# Altium project 3D Printer Control Board.PrjPcb
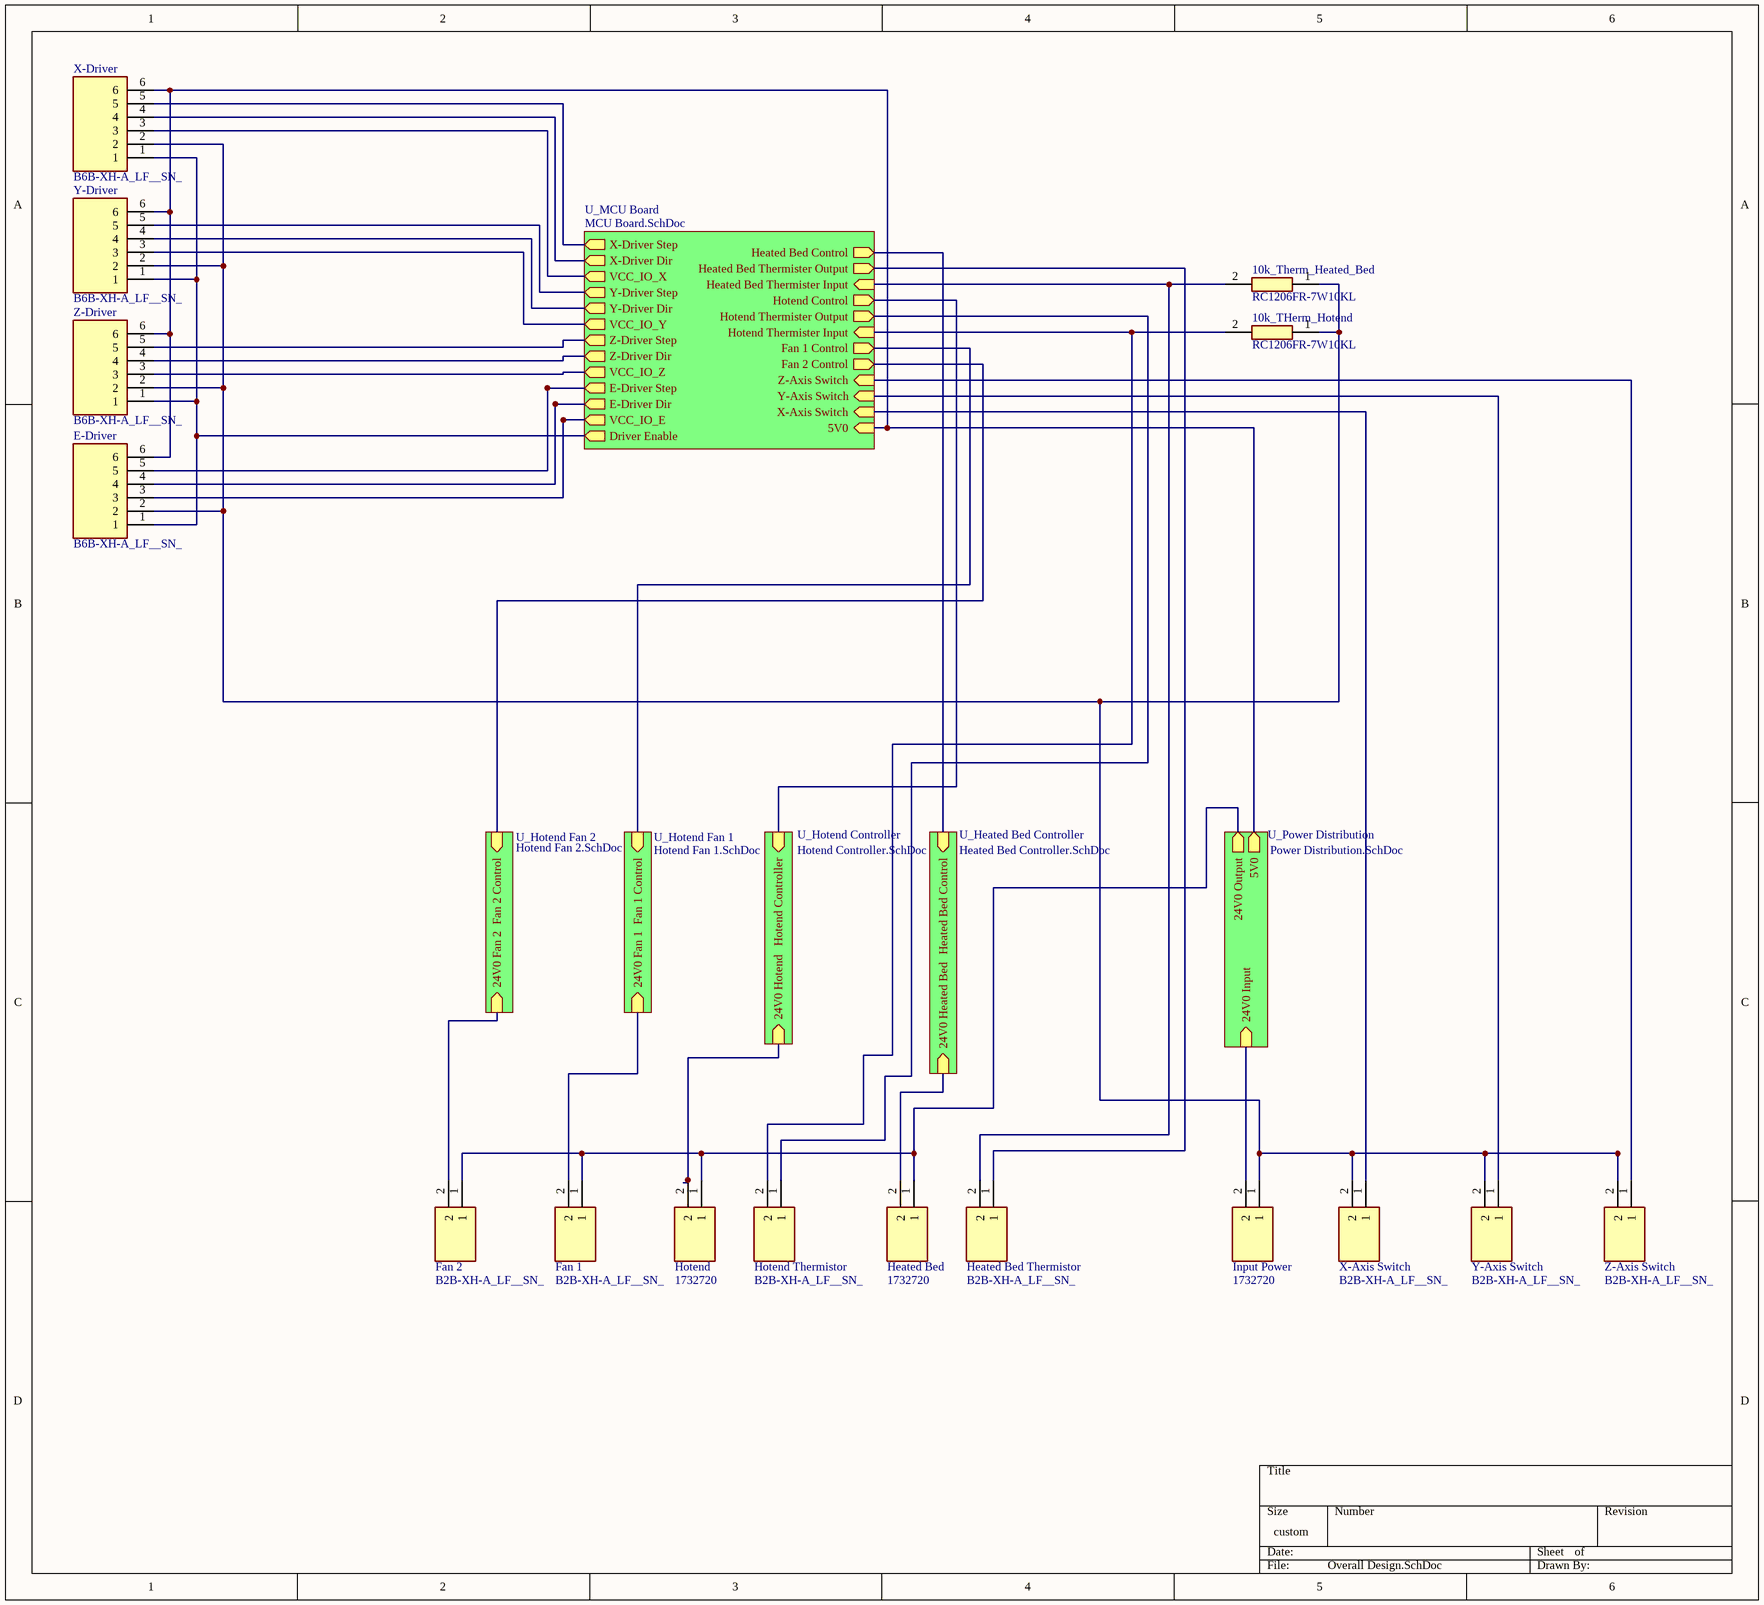
[diagram p0: Overall Design.SchDoc]
4 sheets, 24 parts. Net scope: hierarchical (ports join the sheet entries above them; power ports are global).
Board file: 3d Printer Control PCB.PcbDoc
Sheets:
  Overall Design.SchDoc
    U_Hotend Fan 1 = Hotend Fan 1.SchDoc
    U_Power Distribution = Power Distribution.SchDoc
    U_MCU Board = MCU Board.SchDoc

## Sheet Overall Design.SchDoc
size 330 x 299 mm; SheetNumber: 1; SheetTotal: 7

### Parts
10k_Therm_Heated_Bed  RC1206FR-7W10KL  [RESC3116X65N]
10k_THerm_Hotend  RC1206FR-7W10KL  [RESC3116X65N]
E-Driver  B6B-XH-A_LF__SN_  [SHDR6W64P0X250_1X6_1740X575X700P]
Fan_1  B2B-XH-A_LF__SN_  [SHDR2W64P0X250_1X2_740X575X700P]
Fan_2  B2B-XH-A_LF__SN_  [SHDR2W64P0X250_1X2_740X575X700P]
Heated_Bed  1732720  [1732720]
Heated_Bed_Thermistor  B2B-XH-A_LF__SN_  [SHDR2W64P0X250_1X2_740X575X700P]
Hotend  1732720  [1732720]
Hotend_Thermistor  B2B-XH-A_LF__SN_  [SHDR2W64P0X250_1X2_740X575X700P]
Input_Power  1732720  [1732720]
X-Axis_Switch  B2B-XH-A_LF__SN_  [SHDR2W64P0X250_1X2_740X575X700P]
X-Driver  B6B-XH-A_LF__SN_  [SHDR6W64P0X250_1X6_1740X575X700P]
Y-Axis_Switch  B2B-XH-A_LF__SN_  [SHDR2W64P0X250_1X2_740X575X700P]
Y-Driver  B6B-XH-A_LF__SN_  [SHDR6W64P0X250_1X6_1740X575X700P]
Z-Axis_Switch  B2B-XH-A_LF__SN_  [SHDR2W64P0X250_1X2_740X575X700P]
Z-Driver  B6B-XH-A_LF__SN_  [SHDR6W64P0X250_1X6_1740X575X700P]

### Sub-sheets
U_Heated Bed Controller = Heated Bed Controller.SchDoc (file not in this document): Heated Bed Control (in), 24V0 Heated Bed (in)
U_Hotend Controller = Hotend Controller.SchDoc (file not in this document): Hotend Controller (in), 24V0 Hotend (in)
U_Hotend Fan 1 = Hotend Fan 1.SchDoc: Fan 1 Control (in), 24V0 Fan 1 (in)
U_Hotend Fan 2 = Hotend Fan 2.SchDoc (file not in this document): Fan 2 Control (in), 24V0 Fan 2 (in)
U_MCU Board = MCU Board.SchDoc: X-Driver Dir (out), Y-Driver Dir (out), E-Driver Dir (out), 5V0 (in), X-Axis Switch (in), Y-Axis Switch (in), Z-Axis Switch (in), Driver Enable (out), Heated Bed Control (out), Heated Bed Thermister Output (out), Hotend Control (out), Hotend Thermister Output (out), Heated Bed Thermister Input (in), Hotend Thermister Input (in), Fan 1 Control (out), Fan 2 Control (out), X-Driver Step (out), VCC_IO_X (out), Y-Driver Step (out), VCC_IO_Y (out), Z-Driver Step (out), VCC_IO_Z (out), E-Driver Step (out), VCC_IO_E (out), Z-Driver Dir (out)
U_Power Distribution = Power Distribution.SchDoc: 5V0 (out), 24V0 Output (out), 24V0 Input (in)

### Nets
Net10k_Ohms_Fan_1_2: sheet U_Hotend Fan 1/Fan 1 Control, sheet U_MCU Board/Fan 1 Control
Net10k_Ohms_X-Axis_1: X-Axis_Switch.1 ; sheet U_MCU Board/X-Axis Switch
Net10k_Ohms_Y-Axis_1: Y-Axis_Switch.1 ; sheet U_MCU Board/Y-Axis Switch
Net10k_Ohms_Z-Axis_1: Z-Axis_Switch.1 ; sheet U_MCU Board/Z-Axis Switch
Net10k_Therm_Heated_Bed_1: 10k_Therm_Heated_Bed.1 10k_THerm_Hotend.1 E-Driver.2 Input_Power.1 X-Axis_Switch.2 X-Driver.2 Y-Axis_Switch.2 Y-Driver.2 Z-Axis_Switch.2 Z-Driver.2
Net10k_Therm_Heated_Bed_2: 10k_Therm_Heated_Bed.2 Heated_Bed_Thermistor.2 ; sheet U_MCU Board/Heated Bed Thermister Input
Net10k_THerm_Hotend_2: 10k_THerm_Hotend.2 Hotend_Thermistor.2 ; sheet U_MCU Board/Hotend Thermister Input
NetDC-DC_Converter_1: E-Driver.6 X-Driver.6 Y-Driver.6 Z-Driver.6 ; sheet U_Power Distribution/5V0, sheet U_MCU Board/5V0
NetDC-DC_Converter_9: Fan_1.1 Fan_2.1 Heated_Bed.1 Hotend.1 Input_Power.2 ; sheet U_Power Distribution/24V0 Output, sheet U_Power Distribution/24V0 Input
NetE-Driver_1: E-Driver.1 X-Driver.1 Y-Driver.1 Z-Driver.1 ; sheet U_MCU Board/Driver Enable
NetE-Driver_3: E-Driver.3 ; sheet U_MCU Board/VCC_IO_E
NetE-Driver_4: E-Driver.4 ; sheet U_MCU Board/E-Driver Dir
NetE-Driver_5: E-Driver.5 ; sheet U_MCU Board/E-Driver Step
NetFan_1_2: Fan_1.2 ; sheet U_Hotend Fan 1/24V0 Fan 1
NetFan_2_2: Fan_2.2 ; sheet U_Hotend Fan 2/24V0 Fan 2
NetHeated_Bed_2: Heated_Bed.2 ; sheet U_Heated Bed Controller/24V0 Heated Bed
NetHeated_Bed_Thermistor_1: Heated_Bed_Thermistor.1 ; sheet U_MCU Board/Heated Bed Thermister Output
NetHotend_2: Hotend.2 ; sheet U_Hotend Controller/24V0 Hotend
NetHotend_Thermistor_1: Hotend_Thermistor.1 ; sheet U_MCU Board/Hotend Thermister Output
NetJ?#1_4: X-Driver.3 ; sheet U_MCU Board/VCC_IO_X
NetJ?#1_5: X-Driver.4 ; sheet U_MCU Board/X-Driver Dir
NetJ?#1_6: X-Driver.5 ; sheet U_MCU Board/X-Driver Step
NetJ?#1_7: Y-Driver.3 ; sheet U_MCU Board/VCC_IO_Y
NetJ?#1_8: Y-Driver.4 ; sheet U_MCU Board/Y-Driver Dir
NetJ?#1_9: Y-Driver.5 ; sheet U_MCU Board/Y-Driver Step
NetJ?#1_10: Z-Driver.3 ; sheet U_MCU Board/VCC_IO_Z
NetJ?#1_11: Z-Driver.4 ; sheet U_MCU Board/Z-Driver Dir
NetJ?#1_12: Z-Driver.5 ; sheet U_MCU Board/Z-Driver Step
NetJ?#2_2: sheet U_Heated Bed Controller/Heated Bed Control, sheet U_MCU Board/Heated Bed Control
NetJ?#2_5: sheet U_Hotend Controller/Hotend Controller, sheet U_MCU Board/Hotend Control
NetJ?#2_9: sheet U_Hotend Fan 2/Fan 2 Control, sheet U_MCU Board/Fan 2 Control

### Library data of the parts
10k_Therm_Heated_Bed 10k_THerm_Hotend = RC1206FR-7W10KL: Resistor; Manufacturer_Name: KEMET; Datasheet Link: https://datasheet.datasheetarchive.com/originals/distributors/Datasheets_SAMA/902f9e387b938f871d31120f5fc1d65e.pdf; Height: 0.65mm; Manufacturer_Part_Number: RC1206FR-7W10KL; Arrow Part Number: RC1206FR-7W10KL; Arrow Price/Stock: https://www.arrow.com/en/products/rc1206fr-7w10kl/yageo
E-Driver X-Driver Y-Driver Z-Driver = B6B-XH-A_LF__SN_: Connector; Manufacturer_Name: JST (JAPAN SOLDERLESS TERMINALS); Manufacturer_Part_Number: B6B-XH-A(LF)(SN); Datasheet Link: https://datasheet.lcsc.com/szlcsc/JST-Sales-America-B6B-XH-A-LF-SN_C144397.pdf; Height: 7mm; Arrow Part Number: B6B-XH-A(LF)(SN); Arrow Price/Stock: https://www.arrow.com/en/products/b6b-xh-a-lf-sn/jst-manufacturing?region=europe
Fan_1 Fan_2 Heated_Bed_Thermistor Hotend_Thermistor X-Axis_Switch Y-Axis_Switch Z-Axis_Switch = B2B-XH-A_LF__SN_: Connector; Manufacturer_Name: JST (JAPAN SOLDERLESS TERMINALS); Manufacturer_Part_Number: B2B-XH-A(LF)(SN); Datasheet Link: http://www.jst-mfg.com/product/pdf/eng/eXH.pdf; Height: 7mm; Arrow Part Number: B2B-XH-A(LF)(SN); Arrow Price/Stock: https://www.arrow.com/en/products/b2b-xh-a-lf-sn/jst-manufacturing?region=europe
Heated_Bed Hotend Input_Power = 1732720: Connector; Manufacturer_Name: Phoenix Contact; Datasheet Link: https://media.digikey.com/pdf/Data%20Sheets/Phoenix%20Contact%20PDFs/1732720.pdf; Height: 18mm; Manufacturer_Part_Number: 1732720; Mouser Part Number: 651-1732720; Mouser Price/Stock: https://www.mouser.co.uk/ProductDetail/Phoenix-Contact/1732720?qs=DAHzmYU9cu2maJEX8AM1Kg%3D%3D; Arrow Part Number: 1732720; Arrow Price/Stock: https://www.arrow.com/en/products/1732720/phoenix-contact

## Sheet Hotend Fan 1.SchDoc
size A; SheetNumber: 5; SheetTotal: 8
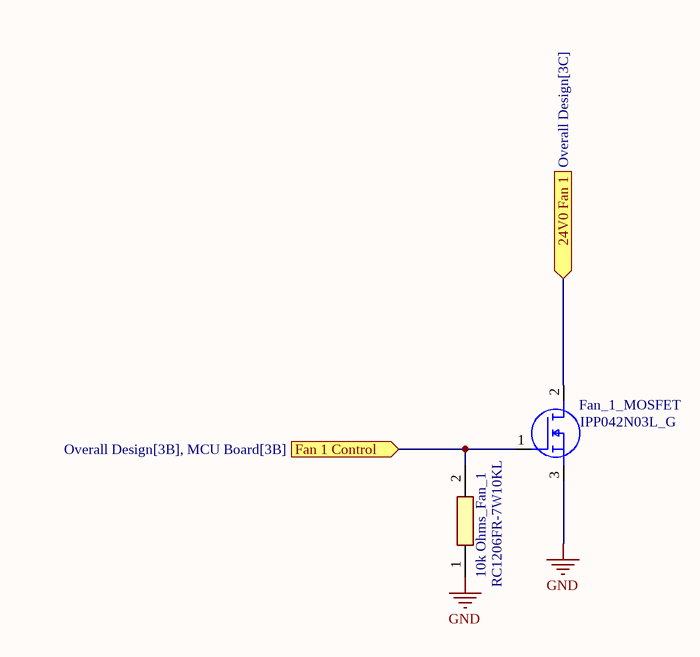
[diagram p1: Hotend Fan 1.SchDoc]

### Parts
10k_Ohms_Fan_1  RC1206FR-7W10KL  [RESC3116X65N]
Fan_1_MOSFET  IPP042N03L_G  [TO254P457X1003X2115-3P]

### Ports
24V0 Fan 1 (in, see Overall Design[3C]), Fan 1 Control (in, see Overall Design[3B], MCU Board[3B])

### Nets
GND: 10k_Ohms_Fan_1.1 Fan_1_MOSFET.3(S)
Net10k_Ohms_Fan_1_2: 10k_Ohms_Fan_1.2 Fan_1_MOSFET.1(G) ; port Fan 1 Control
NetFan_1_2: Fan_1_MOSFET.2(D) ; port 24V0 Fan 1

### Library data of the parts
10k_Ohms_Fan_1 = RC1206FR-7W10KL: Resistor; Manufacturer_Name: KEMET; Datasheet Link: https://datasheet.datasheetarchive.com/originals/distributors/Datasheets_SAMA/902f9e387b938f871d31120f5fc1d65e.pdf; Height: 0.65mm; Manufacturer_Part_Number: RC1206FR-7W10KL; Arrow Part Number: RC1206FR-7W10KL; Arrow Price/Stock: https://www.arrow.com/en/products/rc1206fr-7w10kl/yageo
Fan_1_MOSFET = IPP042N03L_G: MOSFET (N-Channel); Manufacturer_Name: Infineon; Manufacturer_Part_Number: IPP042N03L G; Datasheet Link: https://www.infineon.com/dgdl/Infineon-IPP042N03L-DS-v02_00-en.pdf?fileId=db3a30432313ff5e01239ec50f64709d; Height: 4.57mm; Mouser Part Number: 726-IPP042N03LG; Mouser Price/Stock: https://www.mouser.co.uk/ProductDetail/Infineon-Technologies/IPP042N03L-G?qs=mzcOS1kGbgcoiRIwFnG3QQ%3D%3D

## Sheet Power Distribution.SchDoc
size A; SheetNumber: 7; SheetTotal: 7
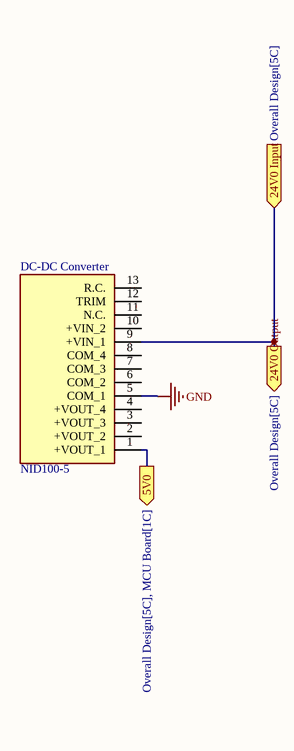
[diagram p2: Power Distribution.SchDoc]

### Parts
DC-DC_Converter  NID100-5  [NID1005]

### Ports
5V0 (out, see Overall Design[5C], MCU Board[1C]), 24V0 Input (in, see Overall Design[5C]), 24V0 Output (out, see Overall Design[5C])

### Nets
GND: DC-DC_Converter.5(COM_1)
NetDC-DC_Converter_1: DC-DC_Converter.1(+VOUT_1) ; port 5V0
NetDC-DC_Converter_9: DC-DC_Converter.9(+VIN_1) ; port 24V0 Output, port 24V0 Input

Not connected (* = marked no-connect by the designer): DC-DC_Converter 2(+VOUT_2) 3(+VOUT_3) 4(+VOUT_4) 6(COM_2) 7(COM_3) 8(COM_4) 10(+VIN_2) 11(N.C.) 12(TRIM) 13(R.C.)

### Library data of the parts
DC-DC_Converter = NID100-5: Power Supply; Manufacturer_Name: Mean Well; Datasheet Link: https://www.meanwell-web.com/content/files/pdfs/productPdfs/MW/NID100/NID100-spec.pdf; Height: 27.5mm; Manufacturer_Part_Number: NID100-5; Mouser Part Number: 709-NID100-5; Mouser Price/Stock: https://www.mouser.co.uk/ProductDetail/MEAN-WELL/NID100-5?qs=u16ybLDytRY%252BLs2ghdXN4Q%3D%3D; Arrow Part Number: NID100-5; Arrow Price/Stock: https://www.arrow.com/en/products/nid100-5/mean-well-enterprises?region=nac

## Sheet MCU Board.SchDoc
size A; SheetNumber: 6; SheetTotal: 7
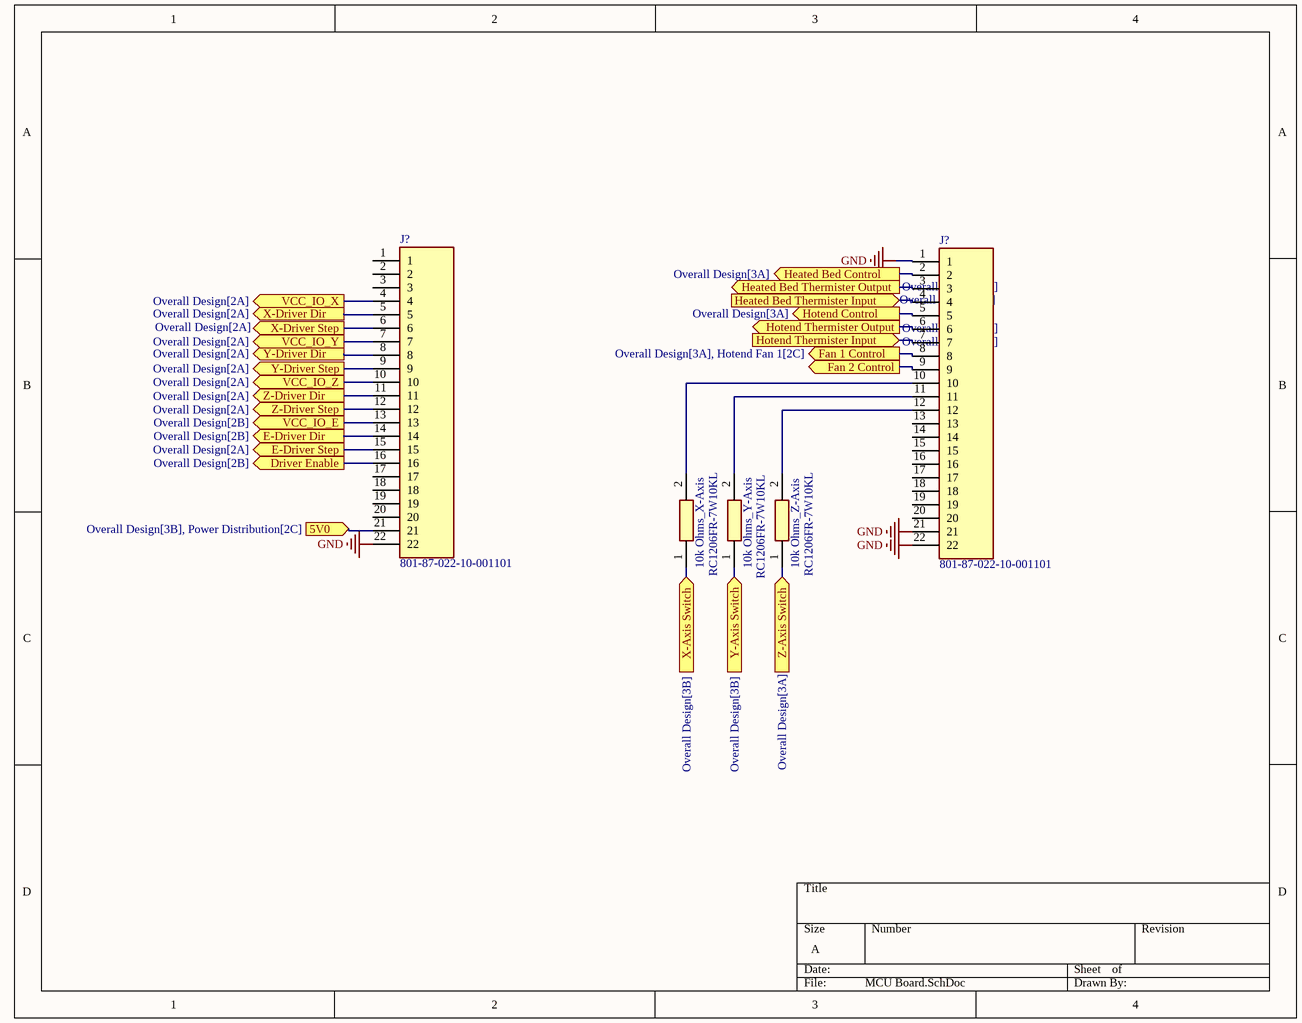
[diagram p3: MCU Board.SchDoc]

### Parts
(Parts that share a designator on the sheet are numbered #1, #2 ... from top to bottom, then left to right.)
10k_Ohms_X-Axis  RC1206FR-7W10KL  [RESC3116X65N]
10k_Ohms_Y-Axis  RC1206FR-7W10KL  [RESC3116X65N]
10k_Ohms_Z-Axis  RC1206FR-7W10KL  [RESC3116X65N]
J?#1  801-87-022-10-001101  [RHDR22W60P0X254_1X22_5588X254X700P]
J?#2  801-87-022-10-001101  [RHDR22W60P0X254_1X22_5588X254X700P]

### Ports
5V0 (in, see Overall Design[3B], Power Distribution[2C]), Driver Enable (out, see Overall Design[2B]), E-Driver Dir (out, see Overall Design[2B]), E-Driver Step (out, see Overall Design[2A]), Fan 1 Control (out, see Overall Design[3A], Hotend Fan 1[2C]), Fan 2 Control (out), Heated Bed Control (out, see Overall Design[3A]), Heated Bed Thermister Input (in, see Overall Design[3A]), Heated Bed Thermister Output (out, see Overall Design[3A]), Hotend Control (out, see Overall Design[3A]), Hotend Thermister Input (in, see Overall Design[3A]), Hotend Thermister Output (out, see Overall Design[3A]), VCC_IO_E (out, see Overall Design[2B]), VCC_IO_X (out, see Overall Design[2A]), VCC_IO_Y (out, see Overall Design[2A]), VCC_IO_Z (out, see Overall Design[2A]), X-Axis Switch (in, see Overall Design[3B]), X-Driver Dir (out, see Overall Design[2A]), X-Driver Step (out, see Overall Design[2A]), Y-Axis Switch (in, see Overall Design[3B]), Y-Driver Dir (out, see Overall Design[2A]), Y-Driver Step (out, see Overall Design[2A]), Z-Axis Switch (in, see Overall Design[3A]), Z-Driver Dir (out, see Overall Design[2A]), Z-Driver Step (out, see Overall Design[2A])

### Nets
GND: J?#1.22 J?#2.1 J?#2.21 J?#2.22
Net10k_Ohms_Fan_1_2: J?#2.8 ; port Fan 1 Control
Net10k_Ohms_X-Axis_1: 10k_Ohms_X-Axis.1 ; port X-Axis Switch
Net10k_Ohms_X-Axis_2: 10k_Ohms_X-Axis.2 J?#2.10
Net10k_Ohms_Y-Axis_1: 10k_Ohms_Y-Axis.1 ; port Y-Axis Switch
Net10k_Ohms_Y-Axis_2: 10k_Ohms_Y-Axis.2 J?#2.11
Net10k_Ohms_Z-Axis_1: 10k_Ohms_Z-Axis.1 ; port Z-Axis Switch
Net10k_Ohms_Z-Axis_2: 10k_Ohms_Z-Axis.2 J?#2.12
Net10k_Therm_Heated_Bed_2: J?#2.4 ; port Heated Bed Thermister Input
Net10k_THerm_Hotend_2: J?#2.7 ; port Hotend Thermister Input
NetDC-DC_Converter_1: J?#1.21 ; port 5V0
NetE-Driver_1: J?#1.16 ; port Driver Enable
NetE-Driver_3: J?#1.13 ; port VCC_IO_E
NetE-Driver_4: J?#1.14 ; port E-Driver Dir
NetE-Driver_5: J?#1.15 ; port E-Driver Step
NetHeated_Bed_Thermistor_1: J?#2.3 ; port Heated Bed Thermister Output
NetHotend_Thermistor_1: J?#2.6 ; port Hotend Thermister Output
NetJ?#1_4: J?#1.4 ; port VCC_IO_X
NetJ?#1_5: J?#1.5 ; port X-Driver Dir
NetJ?#1_6: J?#1.6 ; port X-Driver Step
NetJ?#1_7: J?#1.7 ; port VCC_IO_Y
NetJ?#1_8: J?#1.8 ; port Y-Driver Dir
NetJ?#1_9: J?#1.9 ; port Y-Driver Step
NetJ?#1_10: J?#1.10 ; port VCC_IO_Z
NetJ?#1_11: J?#1.11 ; port Z-Driver Dir
NetJ?#1_12: J?#1.12 ; port Z-Driver Step
NetJ?#2_2: J?#2.2 ; port Heated Bed Control
NetJ?#2_5: J?#2.5 ; port Hotend Control
NetJ?#2_9: J?#2.9 ; port Fan 2 Control

Not connected (* = marked no-connect by the designer): J?#1 1 2 3 17 18 19 20; J?#2 13 14 15 16 17 18 19 20

### Library data of the parts
10k_Ohms_X-Axis 10k_Ohms_Y-Axis 10k_Ohms_Z-Axis = RC1206FR-7W10KL: Resistor; Manufacturer_Name: KEMET; Datasheet Link: https://datasheet.datasheetarchive.com/originals/distributors/Datasheets_SAMA/902f9e387b938f871d31120f5fc1d65e.pdf; Height: 0.65mm; Manufacturer_Part_Number: RC1206FR-7W10KL; Arrow Part Number: RC1206FR-7W10KL; Arrow Price/Stock: https://www.arrow.com/en/products/rc1206fr-7w10kl/yageo
J?#1 J?#2 = 801-87-022-10-001101: Connector; Manufacturer_Name: Preci-Dip; Datasheet Link: https://www.precidip.com/pview/801-PP-NNN-10-001101.html; Height: 7mm; Manufacturer_Part_Number: 801-87-022-10-001101

## Nets that join several sheets
GND: Hotend Fan 1 (10k_Ohms_Fan_1.1 Fan_1_MOSFET.3), Power Distribution (DC-DC_Converter.5), MCU Board (J?#1.22 J?#2.1 J?#2.21 J?#2.22)
Net10k_Ohms_Fan_1_2: Hotend Fan 1 (10k_Ohms_Fan_1.2 Fan_1_MOSFET.1), MCU Board (J?#2.8)
Net10k_Ohms_X-Axis_1: Overall Design (X-Axis_Switch.1), MCU Board (10k_Ohms_X-Axis.1)
Net10k_Ohms_Y-Axis_1: Overall Design (Y-Axis_Switch.1), MCU Board (10k_Ohms_Y-Axis.1)
Net10k_Ohms_Z-Axis_1: Overall Design (Z-Axis_Switch.1), MCU Board (10k_Ohms_Z-Axis.1)
Net10k_Therm_Heated_Bed_2: Overall Design (10k_Therm_Heated_Bed.2 Heated_Bed_Thermistor.2), MCU Board (J?#2.4)
Net10k_THerm_Hotend_2: Overall Design (10k_THerm_Hotend.2 Hotend_Thermistor.2), MCU Board (J?#2.7)
NetDC-DC_Converter_1: Overall Design (E-Driver.6 X-Driver.6 Y-Driver.6 Z-Driver.6), Power Distribution (DC-DC_Converter.1), MCU Board (J?#1.21)
NetDC-DC_Converter_9: Overall Design (5 pins), Power Distribution (DC-DC_Converter.9)
NetE-Driver_1: Overall Design (E-Driver.1 X-Driver.1 Y-Driver.1 Z-Driver.1), MCU Board (J?#1.16)
NetE-Driver_3: Overall Design (E-Driver.3), MCU Board (J?#1.13)
NetE-Driver_4: Overall Design (E-Driver.4), MCU Board (J?#1.14)
NetE-Driver_5: Overall Design (E-Driver.5), MCU Board (J?#1.15)
NetFan_1_2: Overall Design (Fan_1.2), Hotend Fan 1 (Fan_1_MOSFET.2)
NetHeated_Bed_Thermistor_1: Overall Design (Heated_Bed_Thermistor.1), MCU Board (J?#2.3)
NetHotend_Thermistor_1: Overall Design (Hotend_Thermistor.1), MCU Board (J?#2.6)
NetJ?#1_4: Overall Design (X-Driver.3), MCU Board (J?#1.4)
NetJ?#1_5: Overall Design (X-Driver.4), MCU Board (J?#1.5)
NetJ?#1_6: Overall Design (X-Driver.5), MCU Board (J?#1.6)
NetJ?#1_7: Overall Design (Y-Driver.3), MCU Board (J?#1.7)
NetJ?#1_8: Overall Design (Y-Driver.4), MCU Board (J?#1.8)
NetJ?#1_9: Overall Design (Y-Driver.5), MCU Board (J?#1.9)
NetJ?#1_10: Overall Design (Z-Driver.3), MCU Board (J?#1.10)
NetJ?#1_11: Overall Design (Z-Driver.4), MCU Board (J?#1.11)
NetJ?#1_12: Overall Design (Z-Driver.5), MCU Board (J?#1.12)